# EAGLE design 1750_master (EAGLE 7.7.0)
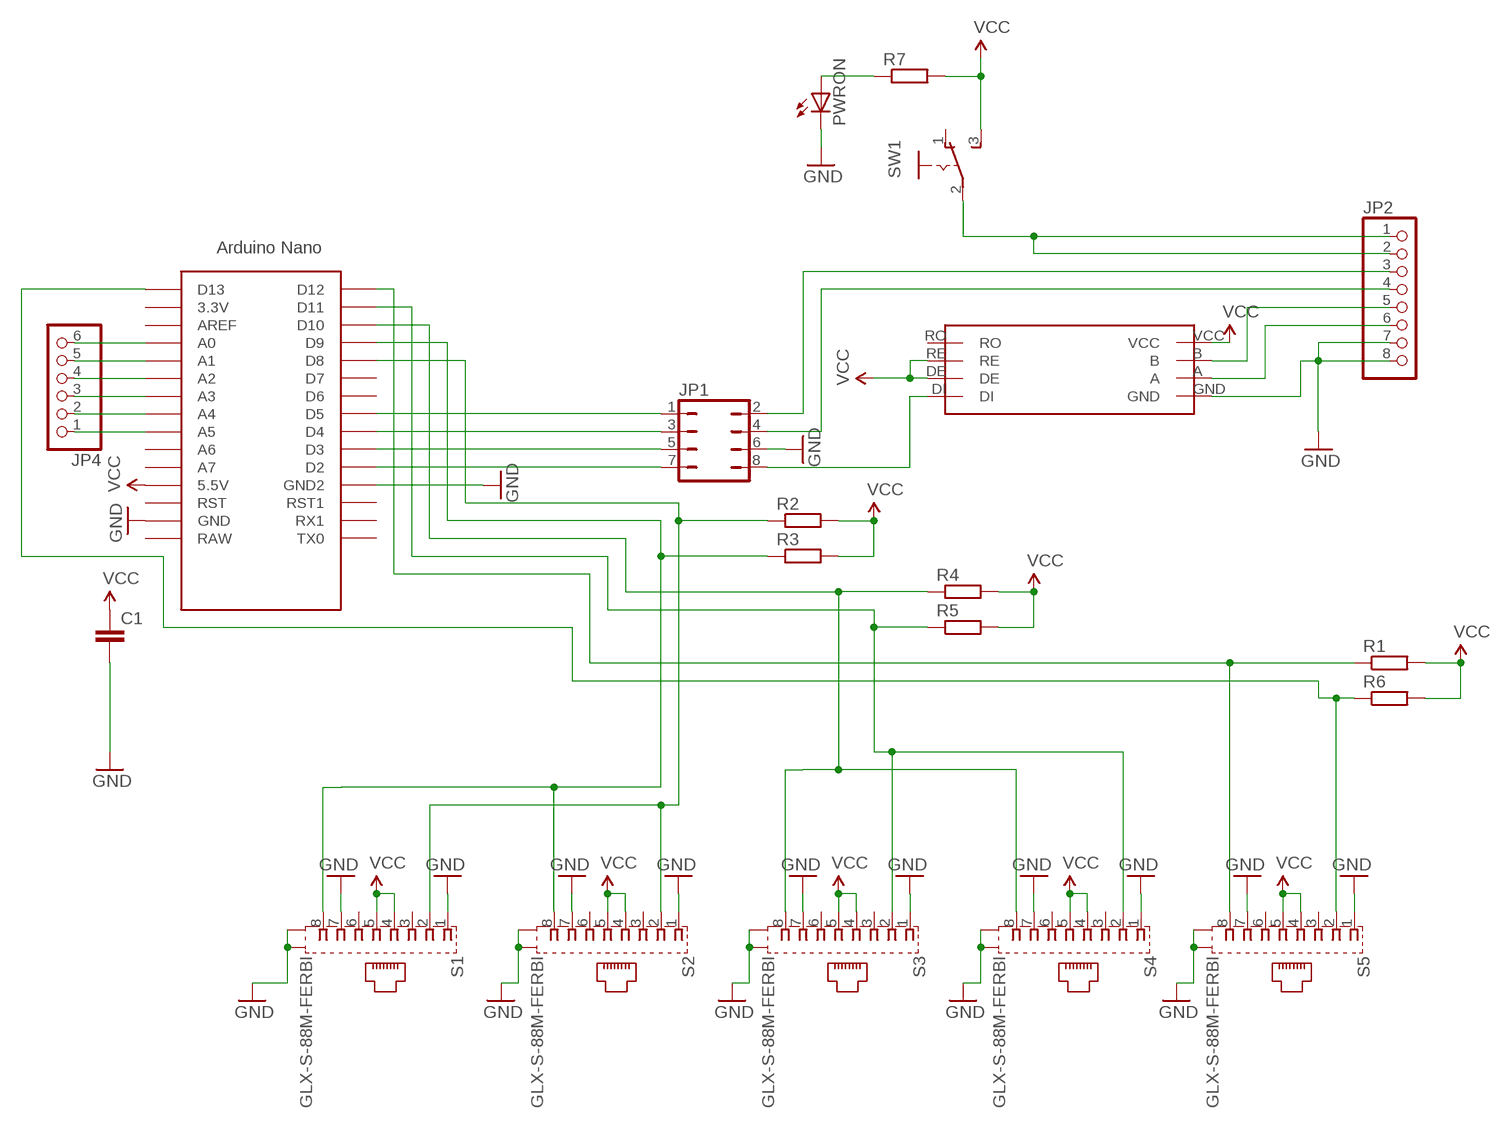
[diagram p0: schematic, sheet 1]

## Parts
C1  C-EU025-025X050  [C025-025X050]
JP1  JP4Q  [JP4Q]
JP2  PINHD-1X8  [1X08]
JP4  PINHD-1X6  [1X06]
PWRON  LED5MM  [LED5MM]
R1  R-EU_0207/10  [0207/10]
R2  R-EU_0207/10  [0207/10]
R3  R-EU_0207/10  [0207/10]
R4  R-EU_0207/10  [0207/10]
R5  R-EU_0207/10  [0207/10]
R6  R-EU_0207/10  [0207/10]
R7  R-EU_0207/10  [0207/10]
S1  GLX-S-88M-FERBI  [GLX-S-88M-FERBI]
S2  GLX-S-88M-FERBI  [GLX-S-88M-FERBI]
S3  GLX-S-88M-FERBI  [GLX-S-88M-FERBI]
S4  GLX-S-88M-FERBI  [GLX-S-88M-FERBI]
S5  GLX-S-88M-FERBI  [GLX-S-88M-FERBI]
SW1  255SB  [255SB]
U$1  NANOF  [NANOF]
U$2  485F  [485F]

## Nets
GND: C1.2 JP1.6 JP2.7 JP2.8 PWRON.K(C) S1.1 S1.7 S1.S1 S1.S2 S2.1 S2.7 S2.S1 S2.S2 S3.1 S3.7 S3.S1 S3.S2 S4.1 S4.7 S4.S1 S4.S2 S5.1 S5.7 S5.S1 S5.S2 U$1.GND U$1.GND1(GND2) U$2.GND
N$1: JP2.5 U$2.B
N$2: JP2.6 U$2.A
N$3: JP1.4 JP2.4
N$4: JP1.2 JP2.3
N$5: JP4.1 U$1.A5
N$6: JP4.2 U$1.A4
N$7: JP1.5 U$1.D3
N$8: JP1.7 U$1.D2
N$9: JP4.3 U$1.A3
N$10: JP4.4 U$1.A2
N$11: JP4.5 U$1.A1
N$12: JP4.6 U$1.A0
N$15: R4.1 S3.8 S4.8 U$1.D10
N$16: JP1.8 U$2.DI
N$17: R5.1 S3.2 S4.2 U$1.D11
N$19: PWRON.A R7.1
N$21: R1.1 S5.8 U$1.D12
N$22: R6.1 S5.2 U$1.D13
N$24: JP2.1 JP2.2 SW1.2(P)
N$25: JP1.3 U$1.D4
N$26: JP1.1 U$1.D5
SCL: R3.1 S1.8 S2.8 U$1.D9
SDA: R2.1 S1.2 S2.2 U$1.D8
VCC: C1.1 R1.2 R2.2 R3.2 R4.2 R5.2 R6.2 R7.2 S1.4 S1.5 S2.4 S2.5 S3.4 S3.5 S4.4 S4.5 S5.4 S5.5 SW1.3(S) U$1.5V(5.5V) U$2.DE U$2.RE U$2.VCC
Unconnected: S1.3 S1.6 S2.3 S2.6 S3.3 S3.6 S4.3 S4.6 S5.3 S5.6 SW1.1(O) U$1.3.3V U$1.A6 U$1.A7 U$1.AREF U$1.D6 U$1.D7 U$1.RAW U$1.RST U$1.RST1 U$1.RX1 U$1.TX0 U$2.RO

## Library data of the parts
C1 = resistor:C-EU: CAPACITOR, European symbol
JP1 = jumper:JP4Q: JUMPER
JP2 = pinhead:PINHD-1X8: PIN HEADER
JP4 = pinhead:PINHD-1X6: PIN HEADER
PWRON = led:LED: LED OSRAM: - CHIPLED LG R971, LG N971, LY N971, LG Q971, LY Q971, LO R971, LY R971 LH N974, LH R974 LS Q976, LO Q976, LY Q976 LO Q996 - Hyper CHIPLED LW Q18S LB Q993, LB Q99A, LB R99A - SideLED LS A670, LO A670, LY A670, LG A670, LP A670 LB A673, LV A673, LT A673, LW A673 LH A674 LY A675 LS A676, LA A676, LO A676, LY A676, LW A676 LS A679, LY A679, LG A679 - Hyper Micro SIDELED® LS Y876, LA Y876, LO Y876, LY Y876 LT Y87S - SmartLED LW L88C, LW L88S LB L89C, LB L89S, LG L890 LS L89K, LO L89K, LY L89K LS L896, LA L896, LO L896, LY L896 - TOPLED LS T670, LO T670, LY T670, LG T670, LP T670 LSG T670, LSP T670, LSY T670, LOP T670, LYG T670 LG T671, LOG T671, LSG T671 LB T673, LV T673, LT T673, LW T673 LH T674 LS T676, LA T676, LO T676, LY T676, LB T676, LH T676, LSB T676, LW T676 LB T67C, LV T67C, LT T67C, LS T67K, LO T67K, LY T67K, LW E67C LS E67B, LA E67B, LO E67B, LY E67B, LB E67C, LV E67C, LT E67C LW T67C LS T679, LY T679, LG T679 LS T770, LO T770, LY T770, LG T770, LP T770 LB T773, LV T773, LT T773, LW T773 LH T774 LS E675, LA E675, LY E675, LS T675 LS T776, LA T776, LO T776, LY T776, LB T776 LHGB T686 LT T68C, LB T68C - Hyper Mini TOPLED® LB M676 - Mini TOPLED Santana® LG M470 LS M47K, LO M47K, LY M47K Source: http://www.osram.convergy.de LUXEON: - LUMILED® LXK2-PW12-R00, LXK2-PW12-S00, LXK2-PW14-U00, LXK2-PW14-V00 LXK2-PM12-R00, LXK2-PM12-S00, LXK2-PM14-U00 LXK2-PE12-Q00, LXK2-PE12-R00, LXK2-PE12-S00, LXK2-PE14-T00, LXK2-PE14-U00 LXK2-PB12-K00, LXK2-PB12-L00, LXK2-PB12-M00, LXK2-PB14-N00, LXK2-PB14-P00, LXK2-PB14-Q00 LXK2-PR12-L00, LXK2-PR12-M00, LXK2-PR14-Q00, LXK2-PR14-R00 LXK2-PD12-Q00, LXK2-PD12-R00, LXK2-PD12-S00 LXK2-PH12-R00, LXK2-PH12-S00 LXK2-PL12-P00, LXK2-PL12-Q00, LXK2-PL12-R00 Source: www.luxeon.com KINGBRIGHT: KA-3528ASYC Source: www.kingbright.com
R1-R7 = resistor:R-EU_: RESISTOR, European symbol
S1-S5 = con-kycon:GLX-S-88M-FERBI: Mod. Jack, Right Angle, 8 posiotion, 8 contatcs RJ45 Source: GLX-S-88M.pdf
SW1 = switch:255SB: SLIDING SWITCH Distributor Buerklin, 11G810
U$1 = Arduino-clone:NANOF
U$2 = rs232-rs485:485F

## Board
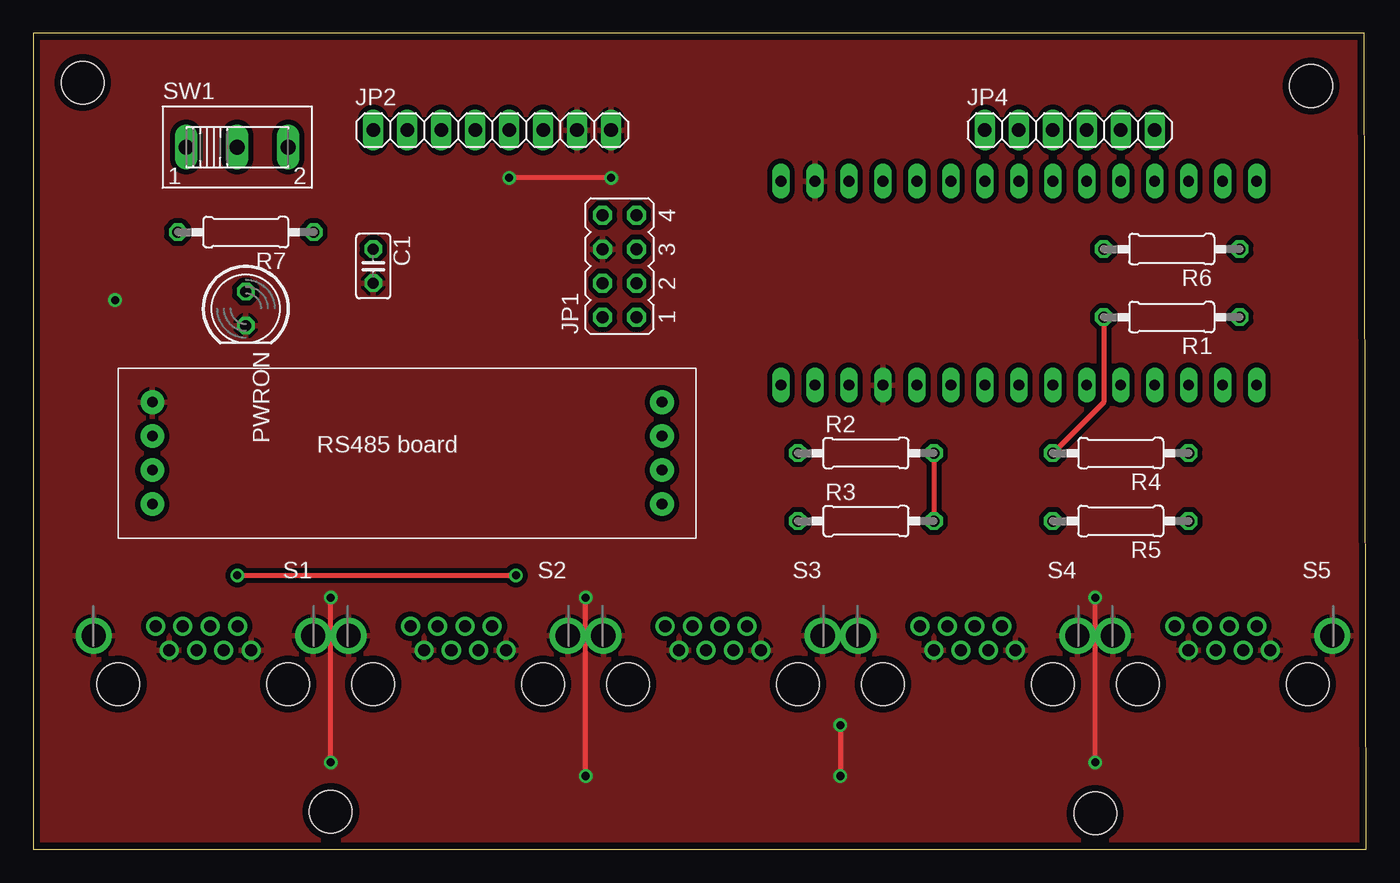
[diagram p1: board, top side]
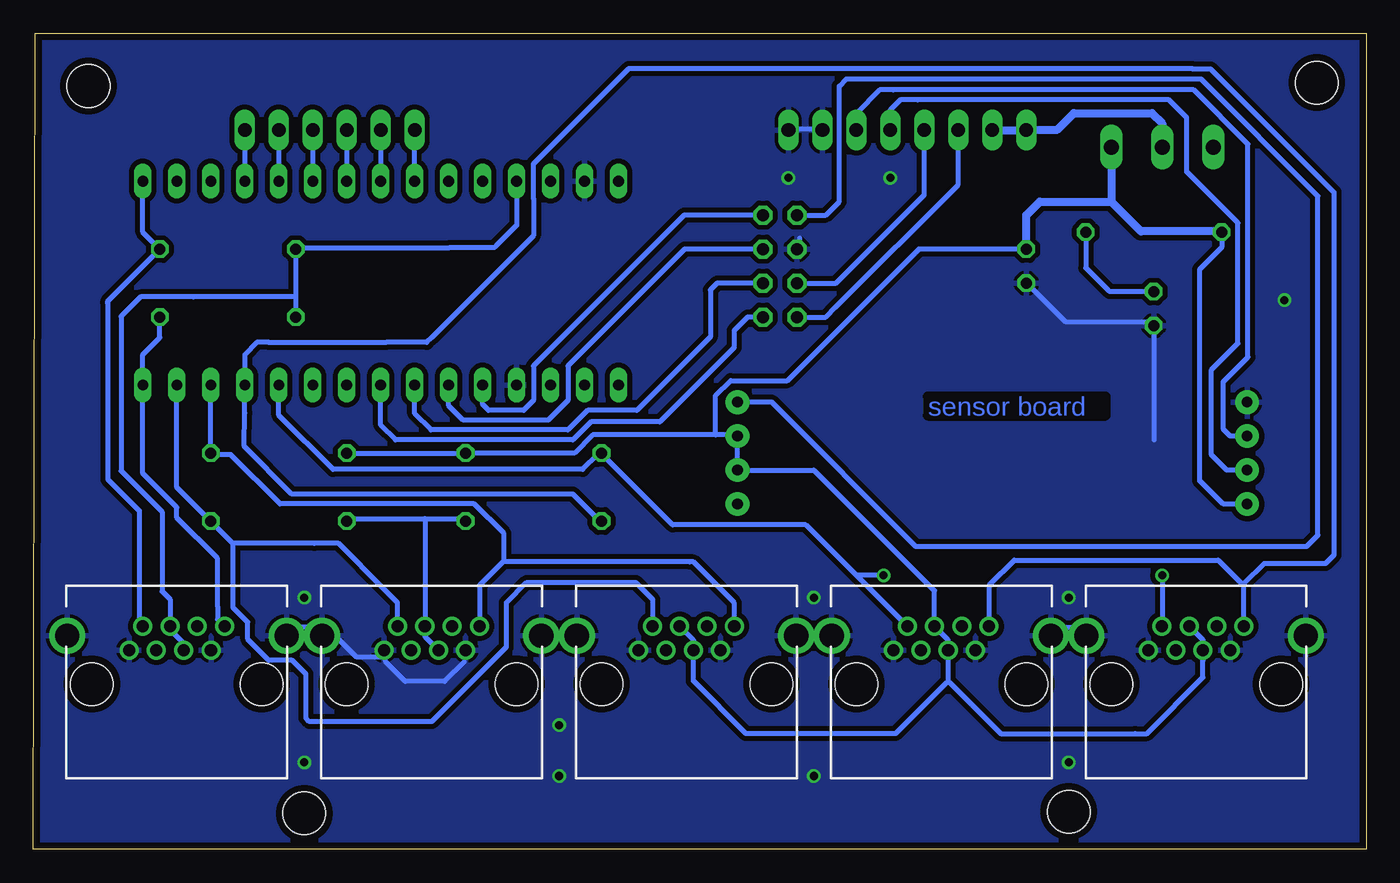
[diagram p2: board, bottom side, seen from below]

Size 99.62 x 60.95 mm. Coordinates in mm from the lower left corner, seen from the top.
Outline: 0,0 99.62,0 99.49,60.95 0,60.95 0,0
Copper layers (1*16): Top 0.035mm / dielectric 1.5mm / Bottom 0.035mm
Design rules "ff": minimum track width 14mil, minimum drill 24mil, track to track 15mil, track to pad 15mil, pad to pad 8mil, via to via 8mil, smd to smd 8mil, copper to edge 20mil, drill to drill 8mil, minimum pad ring 10mil, minimum via ring 8mil, stop-mask expansion 4mil, vias tented up to drill 0mil, thermal gap 10mil
Holes 3.2 mm at 22.23,2.79 79.38,2.67 95.5,57.02 3.68,57.28

### Footprints (pad centres in the part's own frame; a part is rotated, then mirrored left to right if it is on the bottom)
C025-025X050 = drill 0.813 octagon: 1 -1.27,0; 2 1.27,0
JP4Q = drill 0.914 octagon: 1 -3.81,-1.27; 2 -3.81,1.27; 3 -1.27,-1.27; 4 -1.27,1.27; 5 1.27,-1.27; 6 1.27,1.27; 7 3.81,-1.27; 8 3.81,1.27
1X08 = drill 1.016 long: 1 -8.89,0; 2 -6.35,0; 3 -3.81,0; 4 -1.27,0; 5 1.27,0; 6 3.81,0; 7 6.35,0; 8 8.89,0
1X06 = drill 1.016 long: 1 -6.35,0; 2 -3.81,0; 3 -1.27,0; 4 1.27,0; 5 3.81,0; 6 6.35,0
LED5MM = drill 0.813 octagon: A -1.27,0; K 1.27,0
0207/10 = drill 0.813 octagon: 1 -5.08,0; 2 5.08,0
GLX-S-88M-FERBI = drill 0.9 pad 1.422: 1 -3.57,-3.062; 2 -2.55,-4.84; 3 -1.53,-3.062; 4 -0.51,-4.84; 5 0.51,-3.062; 6 1.53,-4.84; 7 2.55,-3.062; 8 3.57,-4.84 | drill 1.803 pad 2.54: S1 -8.2,-4.12; S2 8.2,-4.12 | hole 3.185: -6.35,-0.52; 6.35,-0.52
255SB = drill 1.118 long: 1 -3.81,0; 2 0,0; 3 3.81,0
NANOF = drill 0.8 long: 3.3V -10.16,24.13; 5V -10.16,-1.27; A0 -10.16,19.05; A1 -10.16,16.51; A2 -10.16,13.97; A3 -10.16,11.43; A4 -10.16,8.89; A5 -10.16,6.35; A6 -10.16,3.81; A7 -10.16,1.27; AREF -10.16,21.59; D2 5.08,1.27; D3 5.08,3.81; D4 5.08,6.35; D5 5.08,8.89; D6 5.08,11.43; D7 5.08,13.97; D8 5.08,16.51; D9 5.08,19.05; D10 5.08,21.59; D11 5.08,24.13; D12 5.08,26.67; D13 -10.16,26.67; GND -10.16,-6.35; GND1 5.08,-1.27; RAW -10.16,-8.89; RST -10.16,-3.81; RST1 5.08,-3.81; RX1 5.08,-6.35; TX0 5.08,-8.89
485F = drill 0.8 pad 1.778: A 20.32,5.08; B 20.32,7.62; DE -17.78,5.08; DI -17.78,2.54; GND 20.32,2.54; RE -17.78,7.62; RO -17.78,10.16; VCC 20.32,10.16

### Placement (x,y rotation side)
C1  25.4,43.56 270 top
JP1  43.81,43.56 90 top
JP2  34.29,53.72 0 top
JP4  77.47,53.72 0 top
PWRON  15.88,40.39 270 top
R1  85.09,39.75 180 top
R2  62.23,29.59 0 top
R3  62.23,24.51 0 top
R4  81.28,29.59 180 top
R5  81.28,24.51 180 top
R6  85.09,44.83 180 top
R7  15.88,46.1 180 top
S1  12.7,11.81 180 top
S2  31.75,11.81 180 top
S3  50.8,11.81 180 top
S4  69.85,11.81 180 top
S5  88.9,11.81 180 top
SW1  15.24,52.45 0 top
U$1  64.77,39.75 270 top
U$2  29.21,35.94 180 top

### Tracks (layer width: path | path; a pad name or v marks a point on that pad's centre or on a via)
GND  (via drill 0.6)
  Top 0.356: v60.33,9.27 v60.33,5.46 | v41.27,5.46 v41.27,18.8 | v22.23,6.48 v22.23,18.8 | v79.38,6.48 v79.38,18.8 | v43.18,50.16 v35.56,50.16
  Bottom 0.356: 42.35,45.68 42.35,44.95 JP1.6 | 40.88,53.42 JP2.7 40.88,53.79 43.09,53.79 JP2.8 | C1.2 25.04,42 22.47,39.42 16.2,39.42 PWRON.K 15.84,39.05 15.84,30.58 | 8.84,33.16 U$2.GND | 4.79,16.95 S1.S2 | S1.S1 20.99,16.59 23.57,16.59 S2.S2 | 39.78,16.59 S2.S1 | 42.72,16.59 S3.S2 42.35,16.59 | S5.S2 80.66,16.59 78.08,16.59 S4.S1 77.71,16.59 75.5,14.38 73.66,14.38 S4.1 73.29,14.01 71.82,12.54 68.87,12.54 67.4,14.01 | 61.87,16.59 S4.S2 61.51,16.59 | 58.93,16.59 S3.S1 | 63.35,35 U$1.GND1 | 58.56,49.73 U$1.GND
  other vias: 6.1,41.02 6.1,41.02
  pour Bottom: 0.13,60.83 103.12,60.83 103.12,-0.51 0.13,-0.51
  pour Top: 0.13,60.83 103.12,60.83 103.12,-0.51 0.13,-0.51
N$1
  Bottom 0.356: JP2.5 35.56,55.24 34.81,55.99 33.52,55.99 14.73,55.99 13.4,54.66 13.4,50.61 9.58,46.79 9.58,37.8 11.56,35.81 11.56,29.46 10.41,28.32 U$2.B
N$2
  Bottom 0.356: JP2.6 38.1,54.99 36.36,56.73 35.36,56.73 12.89,56.73 8.84,52.68 8.84,36.75 10.68,34.91 10.67,34.9 10.67,31.37 10.16,30.86 U$2.A
N$3
  Bottom 0.356: JP1.4 39.62,42.29 37.85,44.07 33.02,48.9 JP2.4
N$4
  Bottom 0.356: JP1.2 40.39,39.75 39.62,40.51 30.48,49.66 JP2.3
N$5
  Bottom 0.356: U$1.A5 JP4.1
N$6
  Bottom 0.356: JP4.2 U$1.A4
N$7
  Bottom 0.356: JP1.5 50.94,44.83 51.19,44.58 59.66,36.11 59.66,33.53 61.14,32.05 67.5,32.05 68.58,33.13 U$1.D3
N$8
  Bottom 0.356: JP1.7 50.98,47.37 51.19,47.16 62.24,36.11 62.24,33.53 62.98,32.79 65.61,32.79 66.04,33.22 U$1.D2
N$9
  Bottom 0.356: JP4.3 U$1.A3
N$10
  Bottom 0.356: JP4.4 U$1.A2
N$11
  Bottom 0.356: JP4.5 U$1.A1
N$12
  Bottom 0.356: JP4.6 U$1.A0
N$15
  Bottom 0.356: U$1.D10 R4.1 86.18,29.48 84.86,29.48 81.18,25.79 66.66,25.79 64.45,23.58 64.45,21.53 64.52,21.46 | S3.8 47.23,18.4 50.29,21.46 50.55,21.46 64.52,21.46 | 64.52,21.46 66.04,19.94 66.28,19.7 S4.8
N$16
  Bottom 0.356: U$2.DI 46.27,33.41 44.46,33.41 33.66,22.61 4.46,22.61 3.59,23.47 3.59,48.79 12.33,57.53 18.54,57.53 38.86,57.53 39.37,57.02 39.37,48.39 40.39,47.37 JP1.8
N$17
  Bottom 0.356: 84.71,22.85 84.71,18.06 83.6,16.95 83.6,15.68 82.03,14.11 80.28,14.11 79.25,13.08 79.25,9.78 78.99,9.53 70.36,9.53 69.85,9.53 68.85,10.53 67.82,11.56 65.28,14.1 64.26,15.11 64.26,18.41 62.74,19.94 55.37,19.94 54.61,19.94 53.34,18.67 S3.2 | 84.71,22.85 86.18,24.32 R5.1 86.55,24.69 88.9,27.04 U$1.D11 | 84.71,22.85 78.6,22.85 76.82,22.85 73.41,19.43 72.4,18.43 S4.2
N$19
  Bottom 0.356: R7.1 20.95,43.43 19.3,41.78 19.18,41.66 PWRON.A
N$21
  Bottom 0.356: R1.1 90.17,38.23 91.44,36.96 U$1.D12 91.44,28.07 88.9,25.53 88.9,24.77 85.85,21.72 85.85,18.16 85.85,17.17 S5.8
N$22
  Bottom 0.356: S5.2 91.71,16.95 91.71,25.29 94.06,27.64 94.06,40.75 94.06,40.95 R6.1 91.44,46.1 U$1.D13
N$24
  Bottom 0.356: 25.41,53.79 JP2.1
  Bottom 0.61: JP2.2 JP2.1 23.11,53.72 21.84,54.99 16,54.99 15.24,54.23 SW1.2
N$25
  Bottom 0.356: JP1.3 48.51,42.29 49.02,41.78 49.02,38.28 54.51,32.79 58.19,32.79 59.66,31.32 69.9,31.32 71.12,32.54 U$1.D4
N$26
  Bottom 0.356: JP1.1 46.23,39.75 47.24,38.73 47.24,37.48 52.79,31.93 57.95,31.93 59.3,30.58 72.56,30.58 73.66,31.69 U$1.D5
SCL
  Bottom 0.356: R3.1 57.45,24.69 59.3,26.53 80.3,26.53 83.86,30.09 83.82,32.59 U$1.D9 83.82,36.96 82.92,37.86 82.02,37.86 73.27,37.86 70.22,37.86 69.85,38.23 62.24,45.83 62.24,48.63 62.24,51.21 55.12,58.33 12.99,58.33 12.95,58.29 11.61,58.29 2.41,49.1 2.41,21.97 3.05,21.34 7.62,21.34 9.13,19.83 9.29,19.83 | 9.29,19.83 11.05,21.59 26.29,21.59 28.18,19.7 S2.8 | S1.8 9.13,19.67 arc-90 9.29,19.83
SDA  (via drill 0.6)
  Top 0.356: v15.24,20.45 v36.07,20.45
  Bottom 0.356: 38.1,20.45 41.88,24.24 51.84,24.24 51.93,24.32 57.09,29.48 R2.1 57.45,29.48 58.56,28.37 77.23,28.37 81.28,32.42 U$1.D8 | 38.1,20.45 S2.2 | v36.07,20.45 38.1,20.45 | v15.24,20.45 S1.2
VCC
  Top 0.356: R2.2 R3.2 | R4.2 80.01,33.4 R1.2
  Bottom 0.356: 70.34,24.69 75.87,24.69 R5.2 76.24,24.69 | 70.34,24.69 67.4,24.69 R3.2 | 70.34,24.69 70.34,16.95 S4.4 70.34,16.59 70.34,15.88 S4.5 | 80.03,41.26 80.03,44.58 R6.2 79.92,44.95 68.5,44.95 65.16,44.95 65.02,45.09 63.5,46.61 U$1.5V | 80.03,41.26 80.03,39.79 R1.2 | 80.03,41.26 87.66,41.26 91.62,41.26 93.07,39.81 93.07,28.26 90,25.2 90,19.27 89.41,18.67 S5.4 89.41,16.39 88.39,15.37 S5.5 | R4.2 76.12,29.59 67.65,29.59 R2.2 67.03,29.59 59.18,29.59 57.82,30.95 48.62,30.95 | 48.62,30.95 47.14,30.95 47.08,30.95 U$2.DE 46.99,28.47 46.89,28.37 U$2.RE 41.27,28.32 32.38,19.43 32.26,19.31 S2.4 31.24,15.63 S2.5 31.24,12.58 31.24,12.57 31.37,12.45 | 48.62,30.95 48.62,33.9 47.51,35 43.27,35 33.69,44.58 33.44,44.83 C1.1 | U$2.VCC 10.67,25.78 12.45,27.56 12.45,43.31 11.18,44.58 10.79,44.96 R7.2 10.79,46.16 | S1.4 12.19,15.63 S1.5 12.19,14.11 12.19,12.83 16.38,8.64 17.26,8.64 27.3,8.64 29.46,10.79 31.11,12.45 31.37,12.45 | S3.4 50.29,15.63 S3.5 50.29,12.57 46.35,8.64 37.47,8.64 36.68,8.64 35.18,8.64 31.37,12.45
  Bottom 0.61: SW1.3 19.05,48.39 | C1.1 25.4,47.37 24.38,48.39 19.05,48.39 | 10.79,46.16 16.83,46.16 19.05,48.39

### Text on the board
Bottom: sensor board